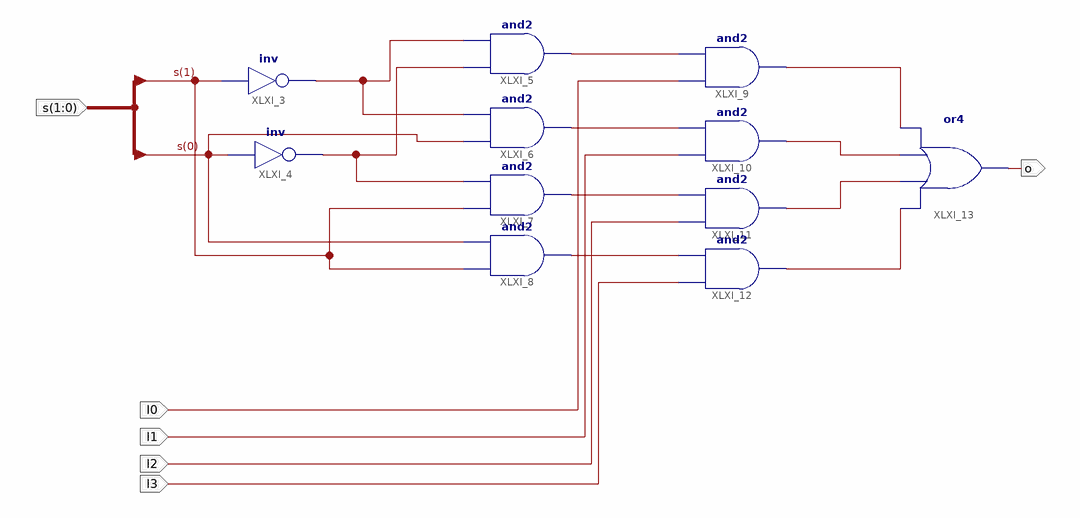
[diagram p0: schematic sheet 1]
// Xilinx ISE schematic Mux4to1_sch.sch (kintex7) as structural Verilog: 11 symbols, 6 ports
module Mux4to1_sch (
  input  [1:0] s,
  input  l1,
  input  l3,
  input  l0,
  input  l2,
  output o
);

  wire XLXN_174, XLXN_175, XLXN_180, XLXN_181, XLXN_182, XLXN_183, XLXN_184, XLXN_185, XLXN_186, XLXN_187;

  not XLXI_3 (XLXN_174, s[1]);
  not XLXI_4 (XLXN_175, s[0]);
  and XLXI_5 (XLXN_180, XLXN_175, XLXN_174);
  and XLXI_6 (XLXN_181, s[0], XLXN_174);
  and XLXI_7 (XLXN_182, s[1], XLXN_175);
  and XLXI_8 (XLXN_183, s[1], s[0]);
  and XLXI_9 (XLXN_184, l0, XLXN_180);
  and XLXI_10 (XLXN_185, l1, XLXN_181);
  and XLXI_11 (XLXN_186, l2, XLXN_182);
  and XLXI_12 (XLXN_187, l3, XLXN_183);
  or XLXI_13 (o, XLXN_187, XLXN_186, XLXN_185, XLXN_184);
endmodule
